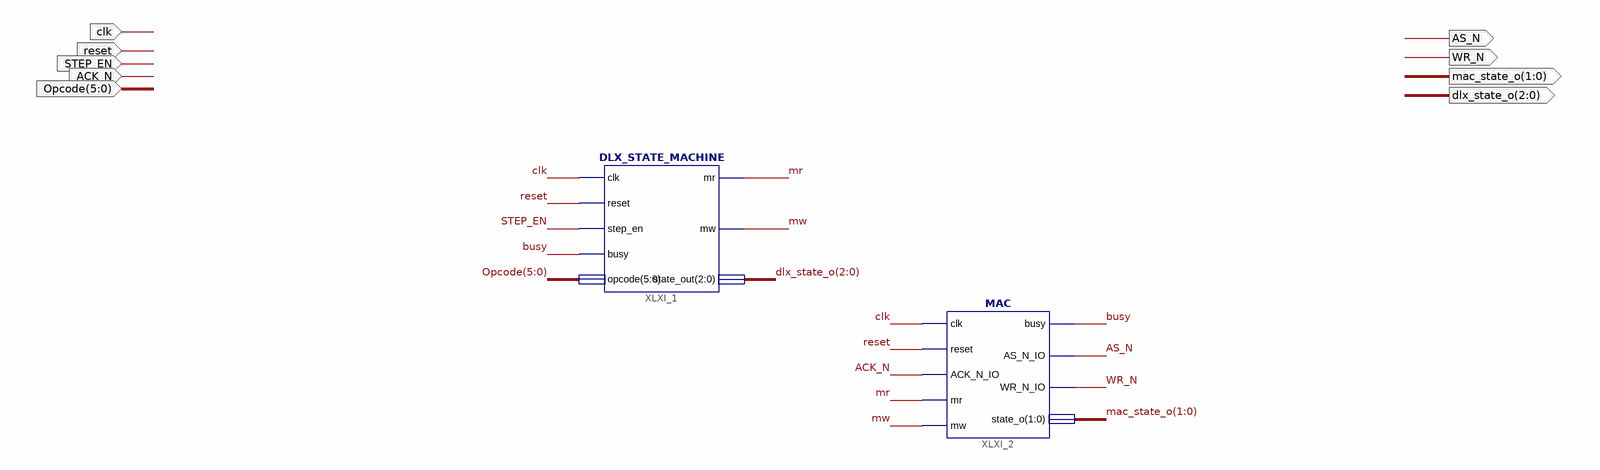
[diagram p0: schematic sheet 1]
// Xilinx ISE schematic Control_LoadStore.sch (spartan6) as structural Verilog: 2 symbols, 9 ports
module Control_LoadStore (
  input  clk,
  input  reset,
  input  STEP_EN,
  input  ACK_N,
  input  [5:0] Opcode,
  output AS_N,
  output WR_N,
  output [1:0] mac_state_o,
  output [2:0] dlx_state_o
);

  wire busy, mr, mw;

  DLX_STATE_MACHINE XLXI_1 (
    .clk(clk), .reset(reset), .step_en(STEP_EN), .busy(busy), .opcode(Opcode), .mr(mr), .mw(mw),
    .state_out(dlx_state_o));
  MAC XLXI_2 (
    .clk(clk), .reset(reset), .ACK_N_IO(ACK_N), .mr(mr), .mw(mw), .busy(busy), .AS_N_IO(AS_N),
    .WR_N_IO(WR_N), .state_o(mac_state_o));
endmodule
